# Altium schematic sheet cSLIM-shield-LoRa.SchDoc
size 297 x 210 mm; SheetNumber: 3; SheetTotal: 12
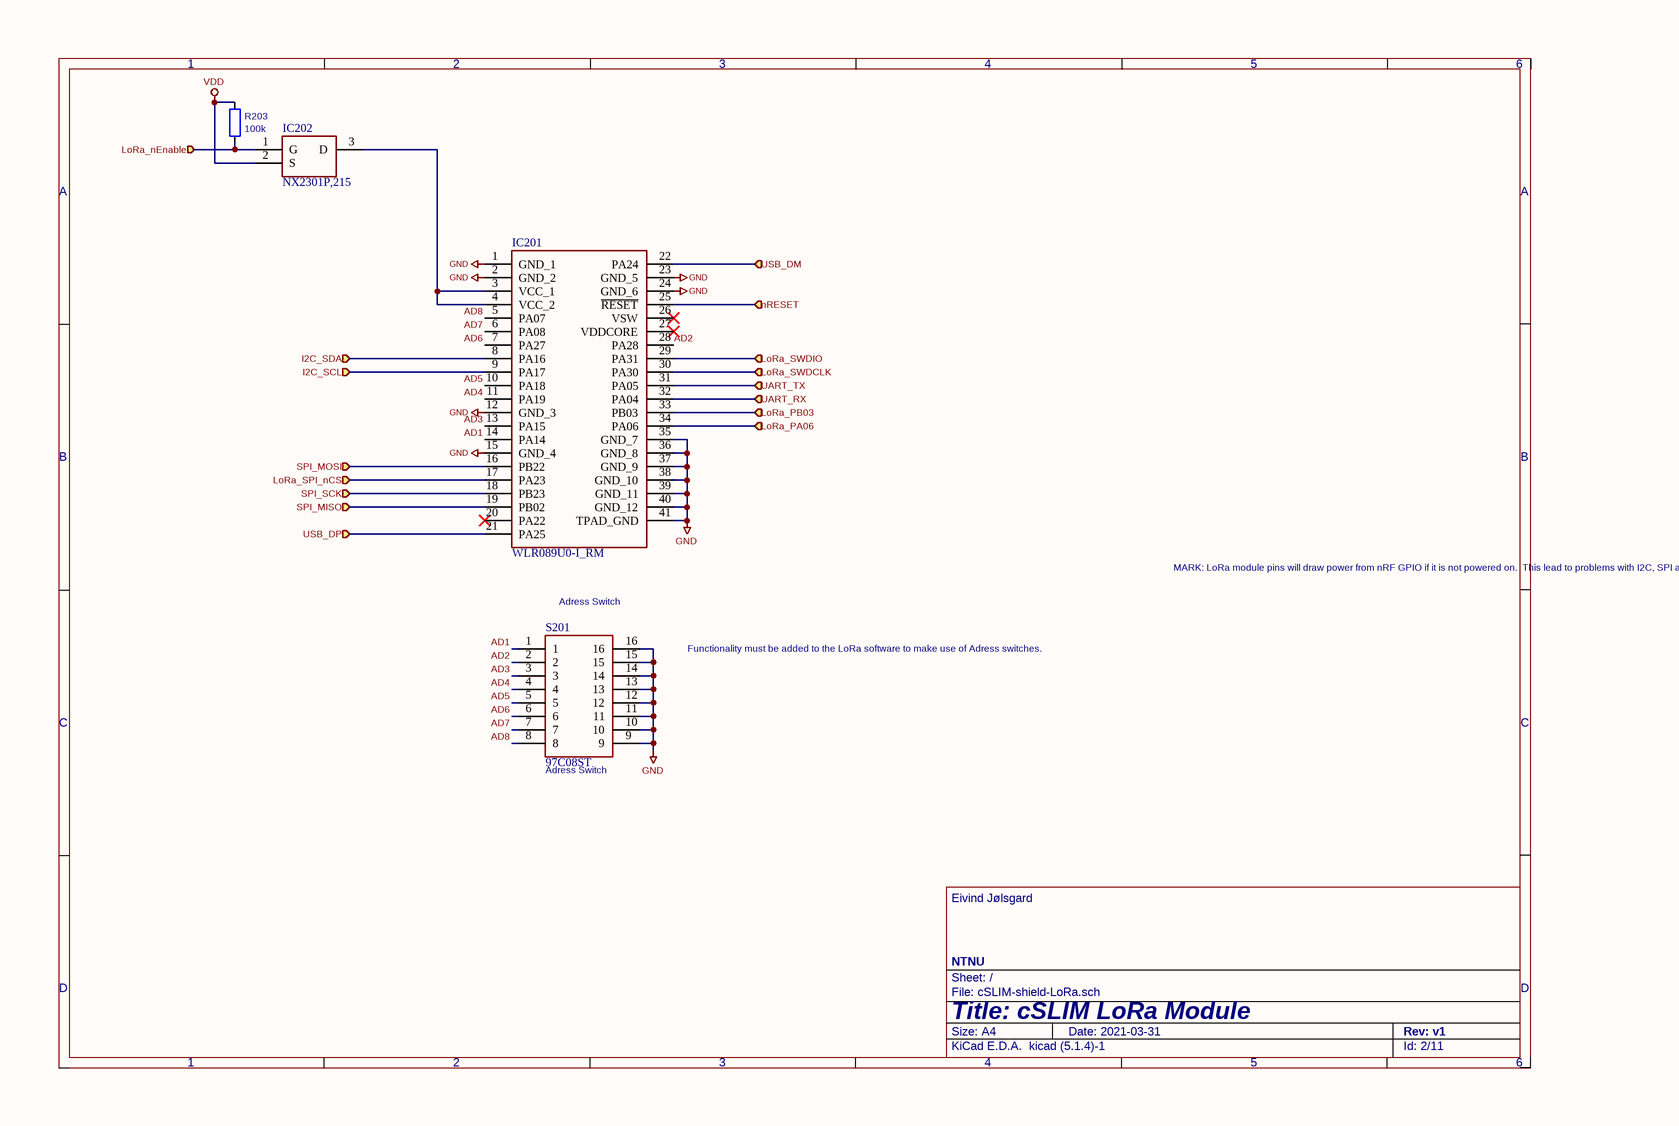
[diagram p0: cSLIM-shield-LoRa.SchDoc]

## Parts
IC201  WLR089U0-I_RM  [WLR089U0IRM]
IC202  NX2301P,215  [SOT95P230X110-3N]
R203  100k  [RESC1608X55N]
S201  97C08ST  [SOIC127P671X170-16N]

## Ports
I2C_SCL (in), I2C_SDA (in), LoRa_nEnable (in), LoRa_PA06 (in), LoRa_PB03 (in), LoRa_SPI_nCS (in), LoRa_SWDCLK (in), LoRa_SWDIO (in), nRESET (in), SPI_MISO (in), SPI_MOSI (in), SPI_SCK (in), UART_RX (in), UART_TX (in), USB_DM (in), USB_DP (in)

## Nets
GND: IC201.1(GND_1) IC201.2(GND_2) IC201.12(GND_3) IC201.15(GND_4) IC201.23(GND_5) IC201.24(GND_6) IC201.35(GND_7) IC201.36(GND_8) IC201.37(GND_9) IC201.38(GND_10) IC201.39(GND_11) IC201.40(GND_12) IC201.41(TPAD_GND) S201.9 S201.10 S201.11 S201.12 S201.13 S201.14 S201.15 S201.16
VDD: IC202.2(S) R203.2
AD1: IC201.14(PA14) S201.1
AD2: IC201.28(PA28) S201.2
AD3: IC201.13(PA15) S201.3
AD4: IC201.11(PA19) S201.4
AD5: IC201.10(PA18) S201.5
AD6: IC201.7(PA27) S201.6
AD7: IC201.6(PA08) S201.7
AD8: IC201.5(PA07) S201.8
I2C_SCL: IC201.9(PA17) ; port I2C_SCL
I2C_SDA: IC201.8(PA16) ; port I2C_SDA
LoRa_nEnable: IC202.1(G) R203.1 ; port LoRa_nEnable
LoRa_PA06: IC201.34(PA06) ; port LoRa_PA06
LoRa_PB03: IC201.33(PB03) ; port LoRa_PB03
LoRa_SPI_nCS: IC201.17(PA23) ; port LoRa_SPI_nCS
LoRa_SWDCLK: IC201.30(PA30) ; port LoRa_SWDCLK
LoRa_SWDIO: IC201.29(PA31) ; port LoRa_SWDIO
nRESET: IC201.25(~{RESET}) ; port nRESET
SPI_MISO: IC201.19(PB02) ; port SPI_MISO
SPI_MOSI: IC201.16(PB22) ; port SPI_MOSI
SPI_SCK: IC201.18(PB23) ; port SPI_SCK
UART_RX: IC201.32(PA04) ; port UART_RX
UART_TX: IC201.31(PA05) ; port UART_TX
USB_DM: IC201.22(PA24) ; port USB_DM
USB_DP: IC201.21(PA25) ; port USB_DP
NetIC201_3: IC201.3(VCC_1) IC201.4(VCC_2) IC202.3(D)

Not connected (* = marked no-connect by the designer): IC201 20(PA22)* 26(VSW)* 27(VDDCORE)*

## Notes on the sheet
- Adress Switch
- MARK: LoRa module pins will draw power from nRF GPIO if it is not powered on.
  This lead to problems with I2C, SPI and UART comunication with other devices.
  Remove unneeded connections and/or insert LLC to ensure tri-state-inputs if
  LoRa module should be powered down completely.
- Functionality must be added to the LoRa software to make use of Adress switches.
- (near S201) Adress Switch
- 1
- 2
- 3
- 4
- 5
- 6
- A
- B
- C
- Eivind Jølsgard
- D
- Title: cSLIM LoRa Module
- File: cSLIM-shield-LoRa.sch
- Sheet: /
- NTNU
- KiCad E.D.A.  kicad (5.1.4)-1
- Size: A4
- Date: 2021-03-31
- Rev: v1
- Id: 2/11

## Library data of the parts
IC201 = WLR089U0-I_RM: Integrated Circuit; Manufacturer_Name: Microchip; Manufacturer_Part_Number: WLR089U0-I/RM; Datasheet Link: https://ww1.microchip.com/downloads/en/DeviceDoc/WLR089U0-Low-Power-LoRa-Sub-GHz-Module-Data-Sheet-DS70005435A.pdf; Height: 2.8mm; Mouser Part Number: 579-WLR089U0-I/RM; Mouser Price/Stock: https://www.mouser.co.uk/ProductDetail/Microchip-Technology/WLR089U0-I-RM?qs=W%2FMpXkg%252BdQ4sfSMsQUYuNg%3D%3D; Arrow Part Number: WLR089U0-I/RM; Arrow Price/Stock: https://www.arrow.com/en/products/wlr089u0-irm/microchip-technology
IC202 = NX2301P,215: Integrated Circuit; Manufacturer_Name: Nexperia; Datasheet Link: http://www.nxp.com/documents/data_sheet/NX2301P.pdf; Height: 1.1mm; Manufacturer_Part_Number: NX2301P,215; Mouser Part Number: 771-NX2301P215; Mouser Price/Stock: https://www.mouser.co.uk/ProductDetail/Nexperia/NX2301P215?qs=A1cBxND5mHKs%252BLrxCDENxw%3D%3D; Arrow Part Number: NX2301P,215; Arrow Price/Stock: https://www.arrow.com/en/products/nx2301p215/nexperia
R203 = R: Value: 100k
S201 = 97C08ST: Switch; Manufacturer_Name: Grayhill; Datasheet Link: http://www.grayhill.com/search/?Keywords=97C08ST; Height: 1.7mm; Manufacturer_Part_Number: 97C08ST; Mouser Part Number: 706-97C08ST; Mouser Price/Stock: https://www.mouser.co.uk/ProductDetail/Grayhill/97C08ST?qs=ls7QRyWmRk6QAl4Hs3wGtw%3D%3D; Arrow Part Number: 97C08ST; Arrow Price/Stock: https://www.arrow.com/en/products/97c08st/grayhill